# EAGLE design wuerfel (EAGLE 6.2)
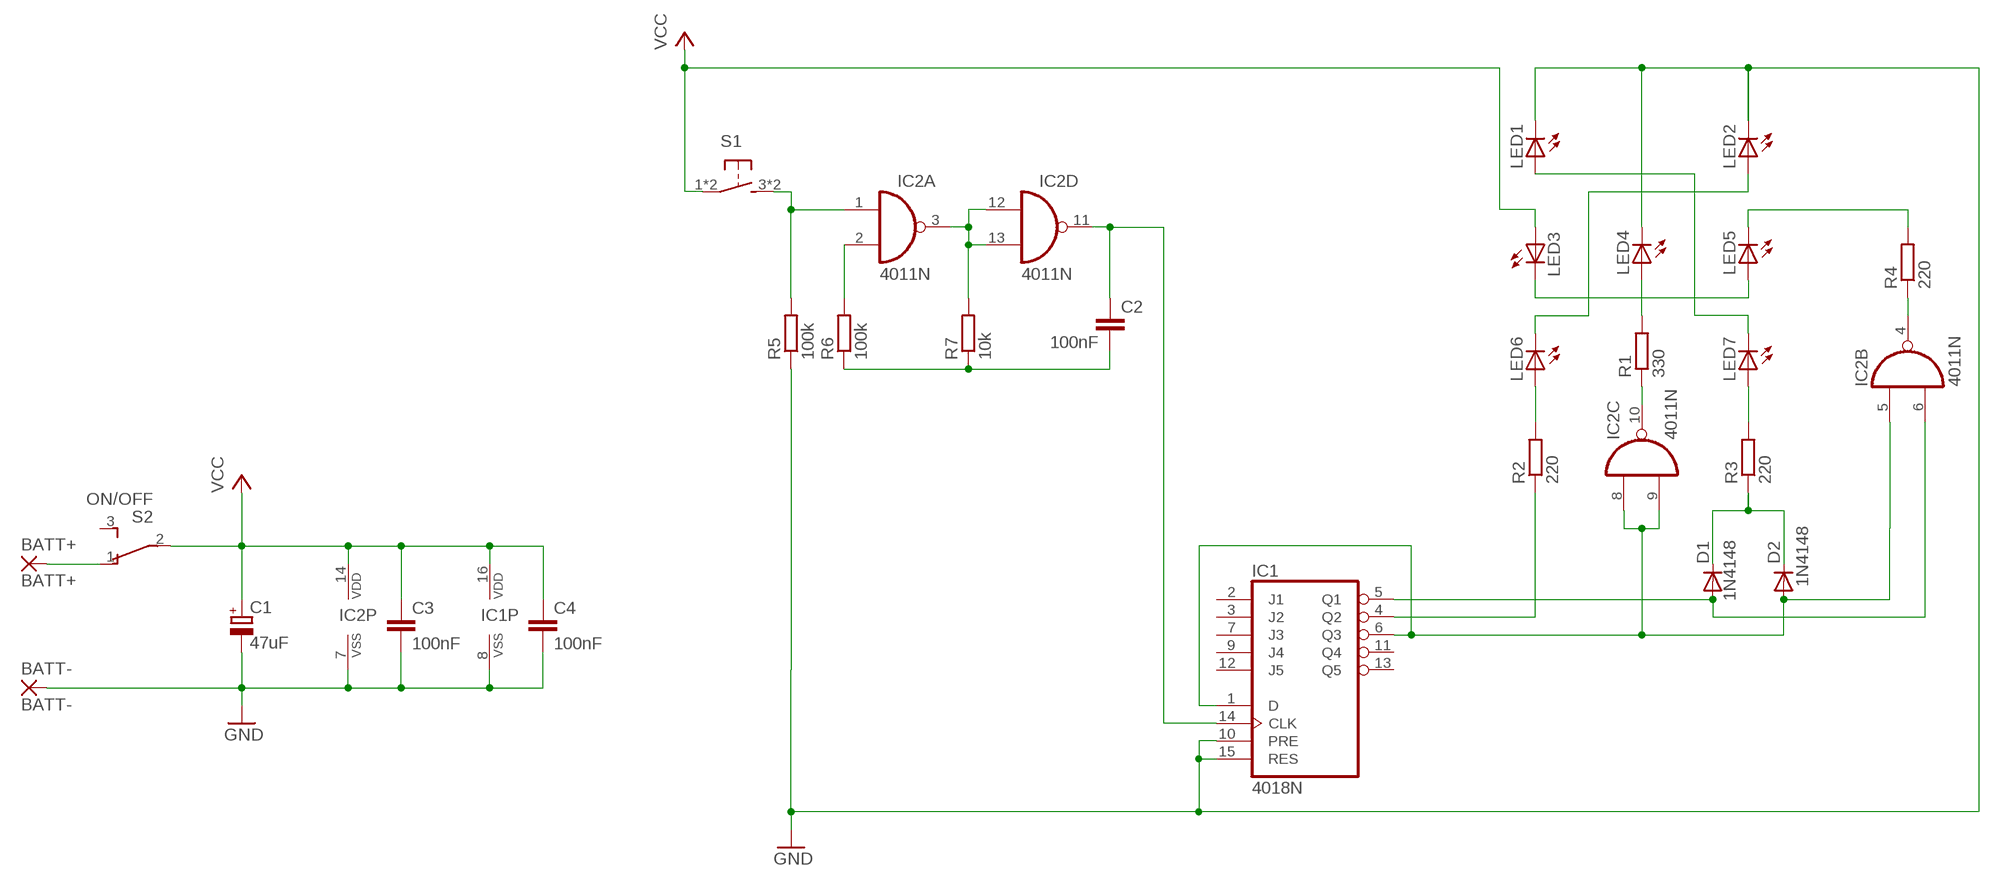
[diagram p0: schematic, sheet 1]

## Parts
BATT+  BATT+  WIREPAD2,54/0,8  [2,54/0,8]
BATT-  BATT-  WIREPAD2,54/0,8  [2,54/0,8]
C1  47uF  CPOL-EUE2.5-5-L-12  [E2,5-5-L-12]
C2  100nF  C-EU025-025X050  [C025-025X050]
C3  100nF  C-EU025-025X050  [C025-025X050]
C4  100nF  C-EU025-025X050  [C025-025X050]
D1  1N4148  1N4148DO35-10  [DO35-10]
D2  1N4148  1N4148DO35-10  [DO35-10]
IC1  4018N  [DIL16]
IC2  4011N  [DIL14]
LED1  LED5MM  [LED5MM]
LED2  LED5MM  [LED5MM]
LED3  LED5MM  [LED5MM]
LED4  LED5MM  [LED5MM]
LED5  LED5MM  [LED5MM]
LED6  LED5MM  [LED5MM]
LED7  LED5MM  [LED5MM]
R1  330  R-EU_0207/10  [0207/10]
R2  220  R-EU_0207/10  [0207/10]
R3  220  R-EU_0207/10  [0207/10]
R4  220  R-EU_0207/10  [0207/10]
R5  100k  R-EU_0207/10  [0207/10]
R6  100k  R-EU_0207/10  [0207/10]
R7  10k  R-EU_0207/10  [0207/10]
S1  TASTER8MM  [TASTER6X6]
S2  ON/OFF  T215T215LB  [T215LB]

## Nets
GND: BATT-.1(P) C1.- C3.2 C4.2 IC1.8(VSS) IC1.10(PRE) IC1.15(RES) IC2.7(P:VSS) LED1.K(C) LED2.K(C) LED4.K(C) R5.1
N$1: IC2.3(A:O) IC2.12(D:I0) IC2.13(D:I1) R7.2
N$2: IC2.2(A:I1) R6.2
N$3: BATT+.1(P) S2.1(O)
N$4: LED6.A R2.2
N$5: IC2.1(A:I0) R5.2 S1.3 S1.4
N$6: LED3.K(C) LED5.A
N$7: LED2.A LED6.K(C)
N$9: LED1.A LED7.K(C)
N$10: C2.1 IC1.14(CLK) IC2.11(D:O)
N$11: LED5.K(C) R4.2
N$12: IC2.4(B:O) R4.1
N$13: LED4.A R1.2
N$15: LED7.A R3.2
N$16: D1.A IC1.5(Q1) IC2.6(B:I1)
N$18: D1.C D2.C R3.1
N$22: IC1.4(Q2) R2.1
N$27: IC2.10(C:O) R1.1
N$28: D2.A IC1.1(D) IC1.6(Q3) IC2.5(B:I0) IC2.8(C:I0) IC2.9(C:I1)
N$29: C2.2 R6.1 R7.1
VCC: C1.+ C3.1 C4.1 IC1.16(VDD) IC2.14(P:VDD) LED3.A S1.1 S1.2 S2.2(P)
Unconnected: IC1.2(J1) IC1.3(J2) IC1.7(J3) IC1.9(J4) IC1.11(Q4) IC1.12(J5) IC1.13(Q5) S2.3(S)

## Library data of the parts
BATT+ BATT- = wirepad:WIREPAD: Wire PAD connect wire on PCB
C1 = elkos:CPOL-EU: POLARIZED CAPACITOR, European symbol
C2-C4 = rcl:C-EU: CAPACITOR, European symbol
D1 D2 = diode:1N4148: DIODE high speed (Philips)
IC1 = 40xx:4018: COUNTER/DIVIDER
IC2 = 40xx:4011: Quad 2-input NAND
LED1-LED7 = led:LED: LED OSRAM: - CHIPLED LG R971, LG N971, LY N971, LG Q971, LY Q971, LO R971, LY R971 LH N974, LH R974 LS Q976, LO Q976, LY Q976 LO Q996 - Hyper CHIPLED LW Q18S LB Q993, LB Q99A, LB R99A - SideLED LS A670, LO A670, LY A670, LG A670, LP A670 LB A673, LV A673, LT A673, LW A673 LH A674 LY A675 LS A676, LA A676, LO A676, LY A676, LW A676 LS A679, LY A679, LG A679 - Hyper Micro SIDELED® LS Y876, LA Y876, LO Y876, LY Y876 LT Y87S - SmartLED LW L88C, LW L88S LB L89C, LB L89S, LG L890 LS L89K, LO L89K, LY L89K LS L896, LA L896, LO L896, LY L896 - TOPLED LS T670, LO T670, LY T670, LG T670, LP T670 LSG T670, LSP T670, LSY T670, LOP T670, LYG T670 LG T671, LOG T671, LSG T671 LB T673, LV T673, LT T673, LW T673 LH T674 LS T676, LA T676, LO T676, LY T676, LB T676, LH T676, LSB T676, LW T676 LB T67C, LV T67C, LT T67C, LS T67K, LO T67K, LY T67K, LW E67C LS E67B, LA E67B, LO E67B, LY E67B, LB E67C, LV E67C, LT E67C LW T67C LS T679, LY T679, LG T679 LS T770, LO T770, LY T770, LG T770, LP T770 LB T773, LV T773, LT T773, LW T773 LH T774 LS E675, LA E675, LY E675, LS T675 LS T776, LA T776, LO T776, LY T776, LB T776 LHGB T686 LT T68C, LB T68C - Hyper Mini TOPLED® LB M676 - Mini TOPLED Santana® LG M470 LS M47K, LO M47K, LY M47K Source: http://www.osram.convergy.de LUXEON: - LUMILED® LXK2-PW12-R00, LXK2-PW12-S00, LXK2-PW14-U00, LXK2-PW14-V00 LXK2-PM12-R00, LXK2-PM12-S00, LXK2-PM14-U00 LXK2-PE12-Q00, LXK2-PE12-R00, LXK2-PE12-S00, LXK2-PE14-T00, LXK2-PE14-U00 LXK2-PB12-K00, LXK2-PB12-L00, LXK2-PB12-M00, LXK2-PB14-N00, LXK2-PB14-P00, LXK2-PB14-Q00 LXK2-PR12-L00, LXK2-PR12-M00, LXK2-PR14-Q00, LXK2-PR14-R00 LXK2-PD12-Q00, LXK2-PD12-R00, LXK2-PD12-S00 LXK2-PH12-R00, LXK2-PH12-S00 LXK2-PL12-P00, LXK2-PL12-Q00, LXK2-PL12-R00 Source: www.luxeon.com KINGBRIGHT: KA-3528ASYC Source: www.kingbright.com
R1-R7 = rcl:R-EU_: RESISTOR, European symbol
S1 = switch:TASTER: Kurzhubtaster vertikale Betätigung, 6x6 mm; REICHELT: TASTER 9305
S2 = switch:T215: TINY SWITCH ON - ON Reichelt Bestellnr: "T 215"

## Board
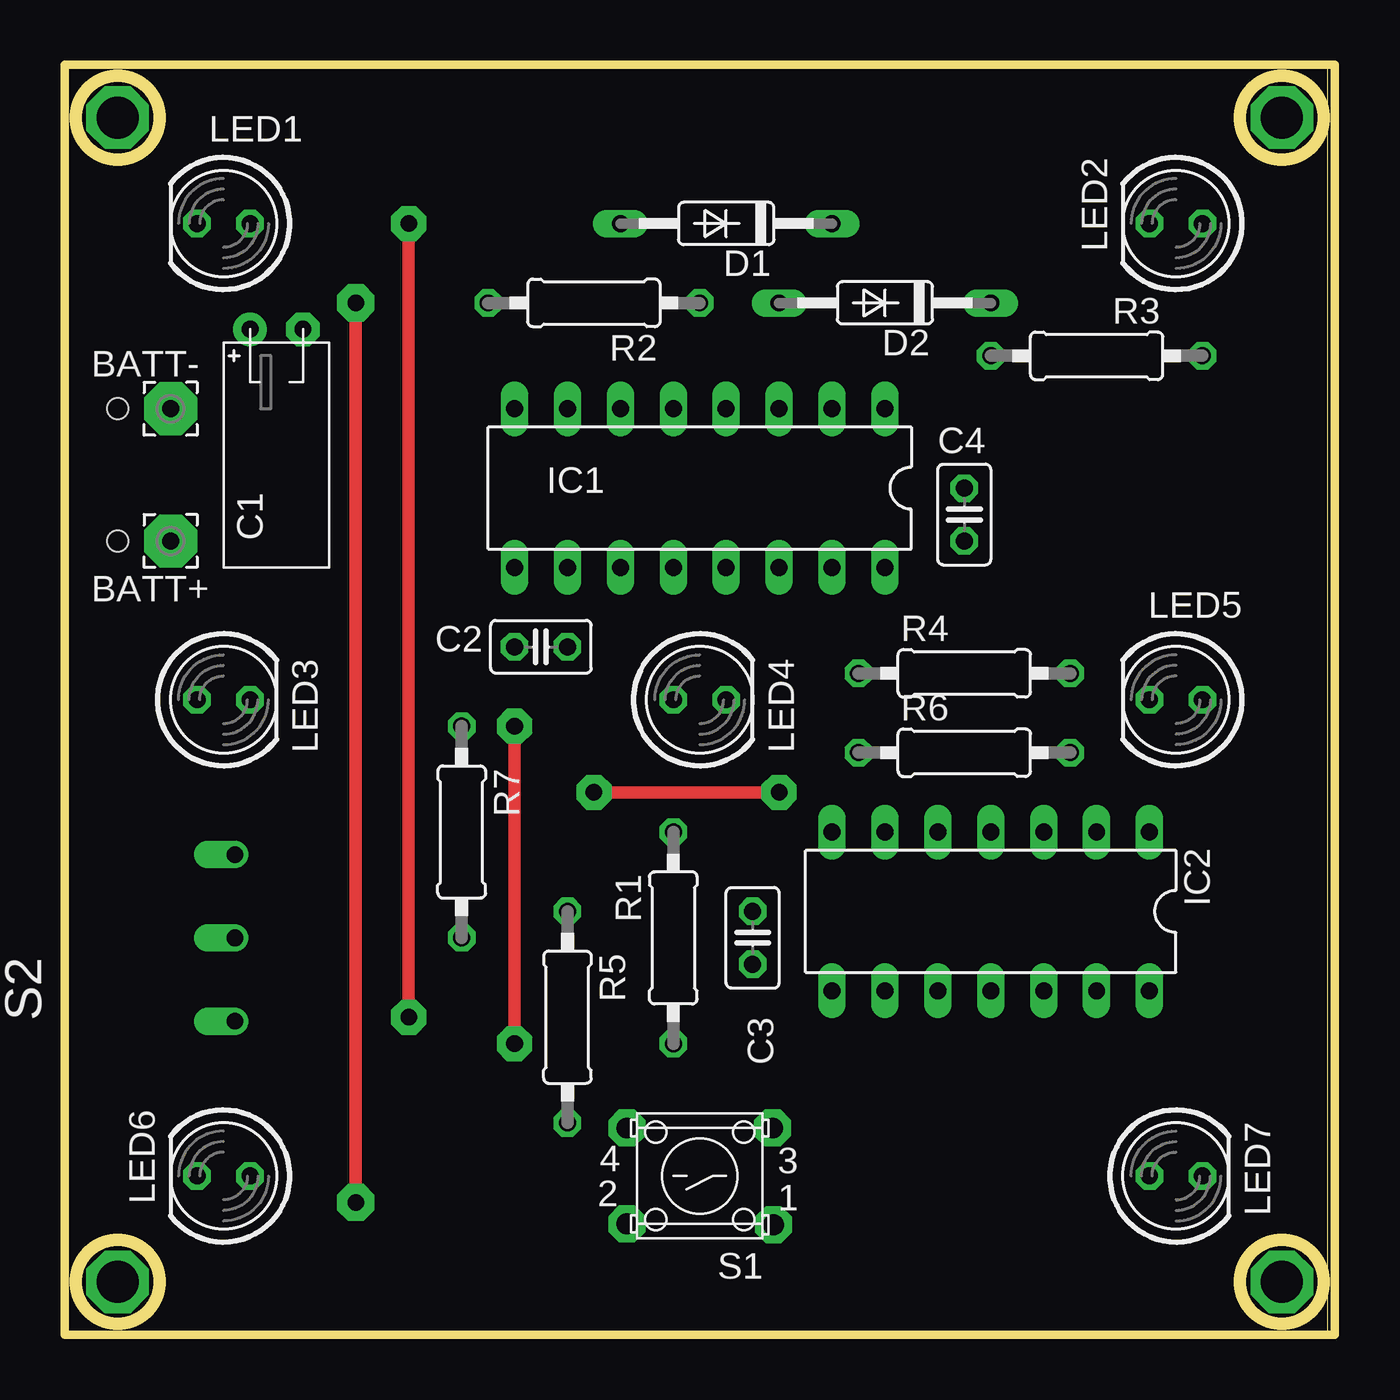
[diagram p1: board, top side]
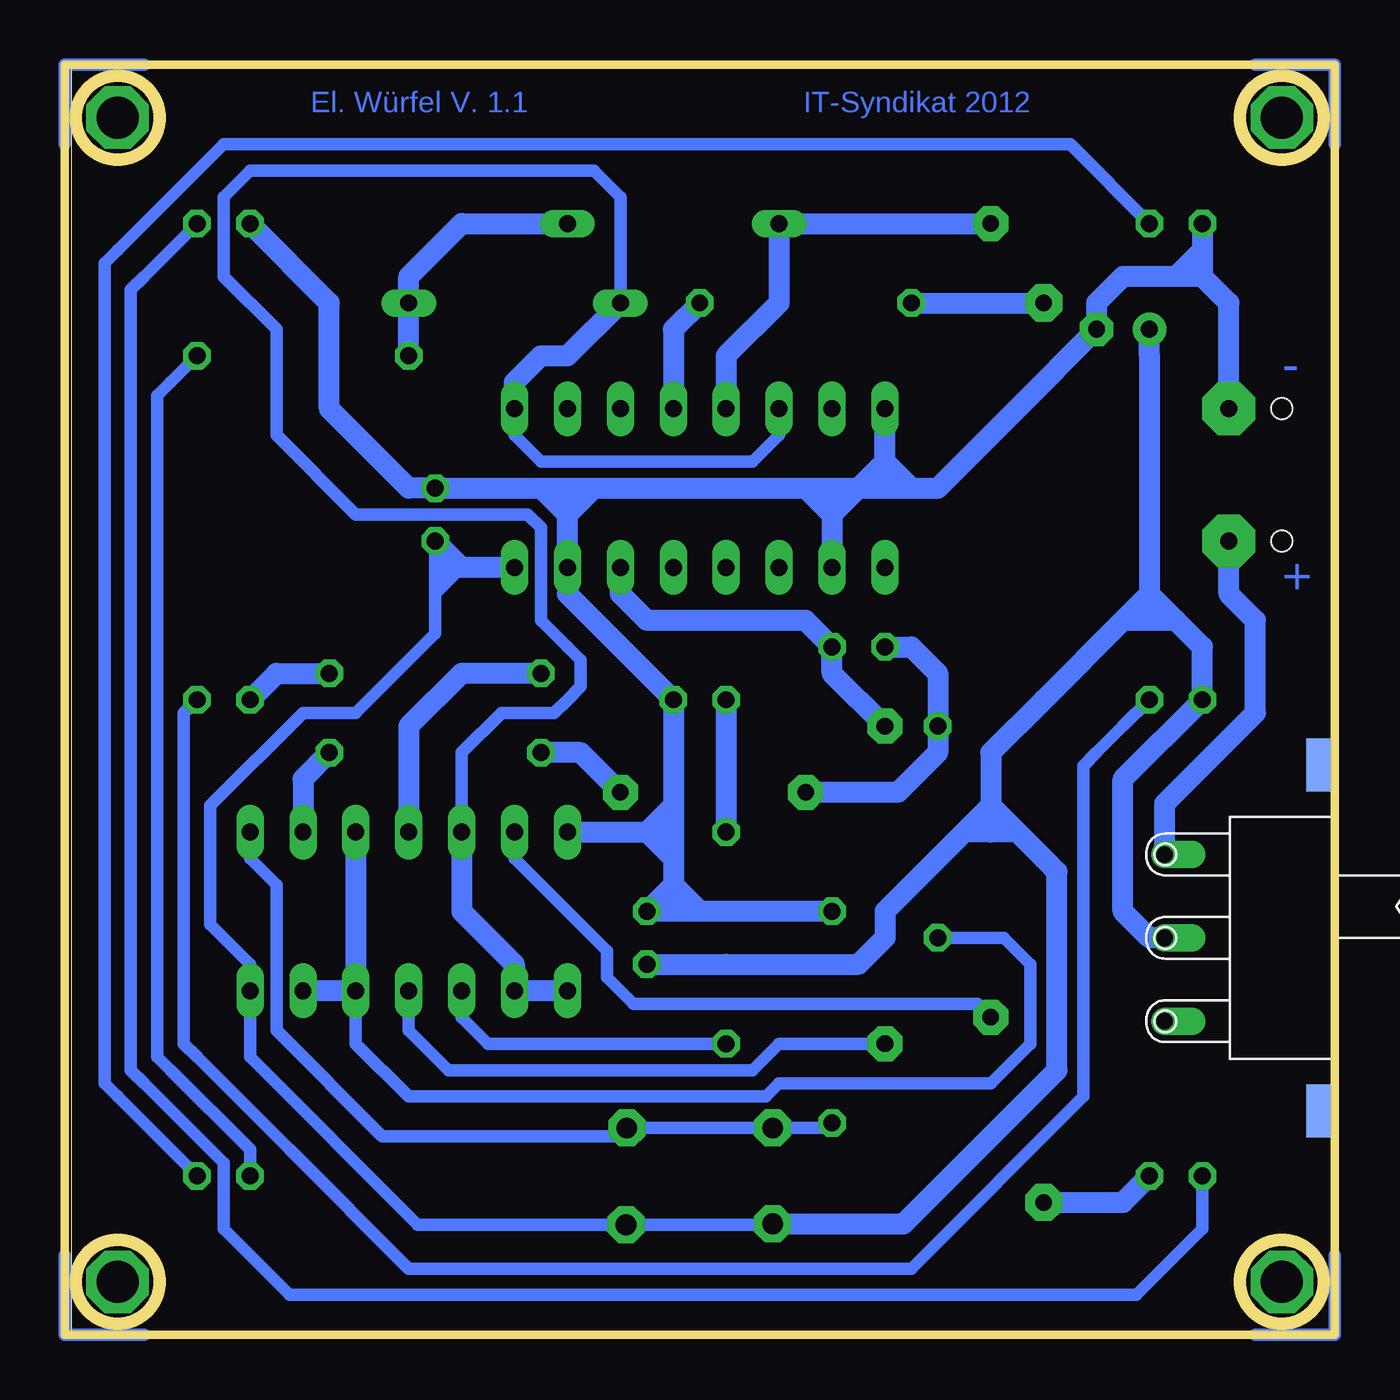
[diagram p2: board, bottom side, seen from below]

Size 60.96 x 60.96 mm. Coordinates in mm from the lower left corner, seen from the top.
Outline: 0,0 60.63,0
Outline: 60.63,0 60.63,60.95 0,60.95 0,60.96
Outline: 0,60.96 0,58.42
Outline: 0,58.42 0,55.88
Outline: 0,55.88 0,53.34 0,52.07 0,50.8
Outline: 0,50.8 0,48.26
Outline: 0,48.26 0,45.72
Outline: 0,45.72 0,43.18
Outline: 0,43.18 0,40.64
Outline: 0,40.64 0,38.1
Outline: 0,38.1 0,35.56
Outline: 0,35.56 0,33.02
Outline: 0,33.02 0,30.48
Outline: 0,30.48 0,27.94
Outline: 0,27.94 0,25.4
Outline: 0,25.4 0,22.86
Outline: 0,22.86 0,20.32
Outline: 0,20.32 0,17.78
Outline: 0,17.78 0,15.24
Outline: 0,15.24 0,12.7
Outline: 0,12.7 0,10.16
Outline: 0,10.16 0,7.62
Outline: 0,7.62 0,5.08
Outline: 0,5.08 0,2.54
Outline: 0,2.54 0,0
Outline: 2.54,60.96 0,60.96
Outline: 0,60.96 2.54,60.96
Outline: 2.54,60.96 5.08,60.96 7.62,60.96 10.16,60.96 12.7,60.96 15.24,60.96 17.78,60.96 20.32,60.96 22.86,60.96 25.4,60.96 27.94,60.96 30.48,60.96 33.02,60.96 35.56,60.96 38.1,60.96 40.64,60.96 43.18,60.96 45.72,60.96 48.26,60.96 50.8,60.96 53.34,60.96 55.88,60.96 58.42,60.96 60.96,60.96 60.96,53.34 60.96,30.48 60.96,16.51 60.96,7.62 60.96,0 60.63,0
Outline: 0,38.1 0,35.56
Outline: 0,35.56 0,33.02
Outline: 0,33.02 0,30.48
Outline: 0,30.48 0,27.94
Outline: 0,27.94 0,25.4
Outline: 0,25.4 0,22.86
Outline: 0,22.86 0,20.32
Outline: 0,20.32 0,17.78
Outline: 0,17.78 0,15.24
Outline: 0,60.96 0,58.42
Outline: 0,58.42 0,55.88
Outline: 0,55.88 0,50.8
Outline: 0,50.8 0,48.26
Outline: 0,48.26 0,45.72
Outline: 0,45.72 0,43.18
Outline: 0,43.18 0,40.64
Outline: 0,40.64 0,38.1
Outline: 0,15.24 0,12.7
Outline: 0,12.7 0,10.16
Outline: 0,10.16 0,7.62
Outline: 0,7.62 0,5.08
Outline: 0,5.08 0,2.54
Outline: 0,2.54 0,0
Outline: 0,0 7.62,0 30.48,0 53.34,0 60.63,0
Outline: circle at 58.42,58.42 radius 2.01
Outline: circle at 2.54,58.42 radius 2.01
Outline: circle at 58.42,2.54 radius 2.01
Outline: circle at 2.54,2.54 radius 2.01
Copper layers (1*16): Top 0.035mm / dielectric 1.5mm / Bottom 0.035mm
Design rules "default": minimum track width 10mil, minimum drill 24mil, track to track 8mil, track to pad 8mil, pad to pad 8mil, via to via 8mil, smd to smd 8mil, copper to edge 40mil, drill to drill 8mil, minimum pad ring 10mil, minimum via ring 8mil, stop-mask expansion 4mil, vias tented up to drill 0mil, thermal gap 10mil
Holes 1 mm at 2.54,44.45 2.54,38.1

### Footprints (pad centres in the part's own frame; a part is rotated, then mirrored left to right if it is on the bottom)
2,54/0,8 = drill 0.813 pad 2.54 octagon: 1 0,0
E2,5-5-L-12 = drill 0.813 pad 1.6: + -1.27,0 | drill 0.813 pad 1.6 octagon: - 1.27,0
C025-025X050 = drill 0.813 octagon: 1 -1.27,0; 2 1.27,0
DO35-10 = drill 0.813 long: A 5.08,0; C -5.08,0
DIL16 = drill 0.813 long: 1 -8.89,-3.81; 2 -6.35,-3.81; 3 -3.81,-3.81; 4 -1.27,-3.81; 5 1.27,-3.81; 6 3.81,-3.81; 7 6.35,-3.81; 8 8.89,-3.81; 9 8.89,3.81; 10 6.35,3.81; 11 3.81,3.81; 12 1.27,3.81; 13 -1.27,3.81; 14 -3.81,3.81; 15 -6.35,3.81; 16 -8.89,3.81
DIL14 = drill 0.813 long: 1 -7.62,-3.81; 2 -5.08,-3.81; 3 -2.54,-3.81; 4 0,-3.81; 5 2.54,-3.81; 6 5.08,-3.81; 7 7.62,-3.81; 8 7.62,3.81; 9 5.08,3.81; 10 2.54,3.81; 11 0,3.81; 12 -2.54,3.81; 13 -5.08,3.81; 14 -7.62,3.81
LED5MM = drill 0.813 octagon: A -1.27,0; K 1.27,0
0207/10 = drill 0.813 octagon: 1 -5.08,0; 2 5.08,0
TASTER6X6 = drill 1 pad 1.778 octagon: 1 -3.54,2.34; 2 3.5,2.3; 3 -3.5,-2.3; 4 3.5,-2.3
T215LB = drill 0.8 offset: 1 -4,-5.625; 2 0,-5.625; 3 4,-5.625 | smd 2.54 x 1.27: MOUNT1 -8.3,1.8; MOUNT2 8.3,1.8

### Placement (x,y rotation side)
BATT+  5.08,38.1 0 top
BATT-  5.08,44.45 0 top
C1  10.16,48.26 0 top
C2  22.86,33.02 180 top
C3  33.02,19.05 90 top
C4  43.18,39.37 90 top
D1  31.75,53.34 180 top
D2  39.37,49.53 180 top
IC1  30.48,40.64 180 top
IC2  44.45,20.32 180 top
LED1  7.62,53.34 180 top
LED2  53.34,53.34 180 top
LED3  7.62,30.48 0 top
LED4  30.48,30.48 0 top
LED5  53.34,30.48 180 top
LED6  7.62,7.62 180 top
LED7  53.34,7.62 0 top
R1  29.21,19.05 90 top
R2  25.4,49.53 180 top
R3  49.53,46.99 0 top
R4  43.18,31.75 0 top
R5  24.13,15.24 270 top
R6  43.18,27.94 0 top
R7  19.05,24.13 270 top
S1  30.48,7.62 180 top
S2  2.54,19.05 270 bottom

### Tracks (layer width: path | path; a pad name or v marks a point on that pad's centre or on a via)
GND
  Bottom 0.61: 51.44,52.7 LED2.K 48.26,49.53 48.26,46.99 48.26,44.45 44.45,40.64 C4.2
  Bottom 1.016: LED1.K 6.35,52.07 | 6.35,52.07 6.99,51.44 | 6.99,51.44 7.62,50.8 | 7.62,50.8 10.16,50.8 11.43,49.53 C1.- 15.24,44.45 19.05,40.64 20.32,40.64 | 31.75,25.4 LED4.K 36.83,35.56 IC1.15 36.83,39.37 | 31.75,25.4 31.75,24.13 | R5.1 30.48,20.32 | 30.48,20.32 31.75,20.32 | 31.75,20.32 C3.2 31.75,21.59 | 31.75,24.13 31.75,22.86 | 31.75,22.86 31.75,21.59 | 31.75,21.59 31.75,20.32 | IC2.7 33.02,24.13 | 33.02,24.13 31.75,24.13 | BATT-.1 5.08,49.53 6.35,50.8 | 6.35,50.8 6.99,51.44 | 6.35,52.07 6.35,50.8 | 6.35,50.8 7.62,50.8 | 38.1,40.64 C4.2 44.45,40.64 48.26,44.45 48.26,49.53 LED2.K | 38.1,40.64 36.83,40.64 | 36.83,40.64 35.56,40.64 | 35.56,40.64 26.67,40.64 25.4,40.64 | 25.4,40.64 24.13,40.64 | 24.13,40.64 22.86,40.64 | 22.86,40.64 21.59,40.64 | 21.59,40.64 20.32,40.64 | 36.83,39.37 36.83,40.64 | 38.1,40.64 36.83,39.37 | 36.83,39.37 35.56,40.64 | 24.13,40.64 24.13,39.37 | 24.13,39.37 IC1.10 | 24.13,39.37 25.4,40.64 | 24.13,39.37 22.86,40.64 | 21.59,40.64 21.59,41.91 | 21.59,41.91 IC1.8 | 21.59,41.91 20.32,40.64 | 21.59,41.91 22.86,40.64 | 31.75,21.59 30.48,20.32 | 31.75,22.86 33.02,24.13 | 33.02,24.13 31.75,25.4
N$1
  Bottom 0.61: IC2.12 IC2.13 | IC2.3 IC2.12 | R7.2 15.88,19.05 14.61,17.78 14.61,13.97 16.51,12.06 26.67,12.06 27.3,11.43 43.18,11.43 44.45,11.43 46.99,13.97 IC2.12
  Bottom 1.016: IC2.13 IC2.12 IC2.3
N$2
  Bottom 0.61: R6.2 49.53,26.67 IC2.2
  Bottom 1.016: R6.2 49.53,26.67 IC2.2
N$3
  Bottom 1.016: BATT+.1 5.08,35.56 3.81,34.29 3.81,29.84 7.54,26.11 8.16,25.49 S2.1
N$4  (via drill 0.8 pad 1.78)
  Top 0.61: v13.97,6.35 v13.97,49.53
  Bottom 0.61: R2.2 17.78,49.53 v13.97,49.53 | 11.43,6.35 v13.97,6.35 10.16,6.35 LED6.A
  Bottom 1.016: v13.97,6.35 10.16,6.35 LED6.A | R2.2 v13.97,49.53
N$5
  Bottom 0.61: R5.2 24.37,9.92 S1.4 S1.3 34.38,9.53 45.72,9.53 50.8,14.61 50.8,15.24 50.8,19.05 50.8,21.59 52.07,22.86 IC2.1
N$6
  Bottom 0.61: LED5.A 55.24,29.84 55.24,13.97 54.61,13.34 50.16,8.89 44.45,3.17 43.81,3.17 20.32,3.17 12.06,11.43 12.06,27.3 11.43,27.94 10.16,29.21 LED3.K
N$7
  Bottom 0.61: LED2.A 57.15,50.8 57.78,50.16 57.78,12.7 57.15,12.06 53.34,8.26 53.34,5.08 50.16,1.91 9.53,1.91 6.35,5.08 LED6.K
N$9
  Bottom 0.61: LED7.K 58.42,11.43 59.05,12.06 59.05,51.44 58.42,52.07 53.34,57.15 12.7,57.15 LED1.A
N$10  (via drill 0.8 pad 1.68)
  Top 0.61: v21.59,13.97 v21.59,29.21
  Bottom 0.61: 42.55,12.7 41.91,12.7 35.56,12.7 | 34.29,35.56 IC1.14 34.29,35.56 | 34.29,35.56 33.66,34.92 | 33.66,34.92 33.02,34.29 | 42.55,12.7 27.94,12.7 26.67,13.97 v21.59,13.97 | IC2.11 44.45,14.61 42.55,12.7 | v21.59,29.21 22.86,30.48 24.13,31.75 C2.1 25.4,34.29 33.02,34.29 | 34.29,35.56 33.66,34.92 | 33.66,34.92 33.02,34.29
  Bottom 1.016: v21.59,29.21 24.13,31.75 C2.1 25.4,34.29 33.02,34.29 34.29,35.56 IC1.14
N$11
  Bottom 0.61: R4.2 50.8,31.75 LED5.K
  Bottom 1.016: LED5.K 50.8,31.75 R4.2
N$12
  Bottom 0.61: IC2.4 44.45,26.67 44.45,27.94 44.45,29.21 41.91,31.75 40.64,31.75 R4.1
  Bottom 1.016: R4.1 41.91,31.75 44.45,29.21 IC2.4
N$13
  Bottom 0.61: LED4.A 29.21,27.94 R1.2
  Bottom 1.016: LED4.A R1.2
N$14
  Bottom 0.61: 3.81,60.96 0,60.96 0,57.15
N$15
  Bottom 0.61: LED7.A 52.07,8.89 55.88,12.7 56.52,13.34 56.52,45.09 55.88,45.72 R3.2
N$16  (via drill 0.8 pad 1.68)
  Top 0.61: v16.51,53.34 16.51,39.37 v16.51,15.24
  Bottom 0.61: IC1.5 29.21,46.99 26.67,49.53 D1.A v16.51,53.34 | IC2.6 39.37,22.86 34.92,18.41 34.92,17.14 33.66,15.88 17.14,15.88 v16.51,15.24
  Bottom 1.016: v16.51,53.34 D1.A 26.67,49.53 29.21,46.99 IC1.5
N$17
  Bottom 0.61: 57.15,60.96 60.96,60.96 60.96,57.15
N$18
  Bottom 0.61: R3.1 D2.C 44.45,50.8 41.91,53.34 D1.C
  Bottom 1.016: R3.1 D2.C 44.45,50.8 41.91,53.34 D1.C
N$19
  Bottom 0.61: 60.96,3.81 60.96,0 57.15,0
N$20
  Bottom 0.61: 3.81,0 0,0 0,3.81
N$22
  Bottom 0.61: R2.1 31.75,48.26 IC1.4
  Bottom 1.016: R2.1 31.75,48.26 IC1.4
N$23  (via drill 2 pad 1.78)
  other vias: 58.42,2.54
N$24  (via drill 2 pad 1.78)
  other vias: 2.54,2.54
N$25  (via drill 2 pad 1.78)
  other vias: 58.42,58.42
N$26  (via drill 2 pad 1.78)
  other vias: 2.54,58.42
N$27
  Bottom 0.61: R1.1 36.83,13.97 40.64,13.97 41.91,15.24 IC2.10
N$28
  Bottom 0.61: IC1.1 39.37,43.18 | IC1.6 26.67,43.18 27.94,41.91 30.48,41.91 38.1,41.91 39.37,43.18 | IC1.1 39.37,43.18 | 50.8,55.88 52.07,55.88 | 39.37,43.18 IC1.1 | 50.8,55.88 52.07,55.88 | 52.07,55.88 53.34,54.61 53.34,52.07 53.34,50.8 50.8,48.26 50.8,45.72 50.8,43.18 46.99,39.37 44.45,39.37 39.37,39.37 | IC1.1 39.37,45.72 38.1,46.99 36.83,46.99 D2.A 34.29,54.61 35.56,55.88 50.8,55.88 | 38.1,34.29 36.83,33.02 | 38.1,34.29 38.1,38.73 38.73,39.37 39.37,39.37 | 38.1,34.29 36.83,33.02 | 36.83,33.02 36.2,32.38 36.2,31.11 36.83,30.48 37.47,29.84 38.73,29.84 40.01,29.84 41.91,27.94 41.91,26.67 41.91,25.4 IC2.5 41.91,20.32 39.37,17.78 IC2.9 IC2.8 | 39.37,39.37 40.01,39.37
  Bottom 1.016: IC2.8 IC2.9 39.37,17.78 41.91,20.32 IC2.5 | IC1.1 39.37,45.72 38.1,46.99 36.83,46.99 D2.A
N$29  (via drill 0.8 pad 1.68)
  Top 0.61: v25.4,26.04 v34.29,26.04
  Bottom 0.61: C2.2 20.32,33.02 19.05,31.75 R7.1 19.05,27.94 20.95,26.04 v25.4,26.04 | v34.29,26.04 36.2,27.94 R6.1
  Bottom 1.016: C2.2 20.32,33.02 19.05,31.75 R7.1 19.05,27.94 20.95,26.04 v25.4,26.04 | v34.29,26.04 36.2,27.94 R6.1
VCC
  Bottom 0.61: 43.18,35.56 43.18,33.66 46.99,29.84 49.53,29.84 53.98,25.4 53.98,19.68 52.07,17.78 IC2.14 52.07,13.34 44.02,5.28 S1.1 27.02,5.28 S1.2 | 43.18,35.56 43.18,36.83 | 43.18,36.83 C4.1 | 41.91,36.83 43.18,35.56 | 43.18,35.56 43.18,36.2 42.55,36.83 43.18,36.83
  Bottom 1.016: C1.+ 8.89,46.99 8.89,35.56 | C3.1 29.21,17.78 22.86,17.78 21.59,19.05 21.59,20.32 17.78,24.13 | 16.51,25.4 16.51,27.94 13.97,30.48 10.16,34.29 | 16.51,25.4 15.24,24.13 | 15.24,24.13 13.97,22.86 13.34,22.23 13.34,12.7 20.71,5.32 S1.2 | 16.51,25.4 17.78,24.13 | 7.62,34.29 6.35,33.02 LED3.A 10.16,26.67 10.16,20.32 8.89,19.05 S2.2 | 7.62,34.29 8.89,35.56 | 8.89,35.56 10.16,34.29 | IC1.16 41.91,36.83 C4.1 | 15.24,24.13 16.51,24.13 | 16.51,24.13 17.78,24.13 | 16.51,24.13 16.51,25.4 | 7.62,34.29 8.89,34.29 | 8.89,34.29 10.16,34.29 | 8.89,34.29 8.89,35.56

### Text on the board
Bottom: IT-Syndikat 2012 | El. Würfel V. 1.1 | - | +